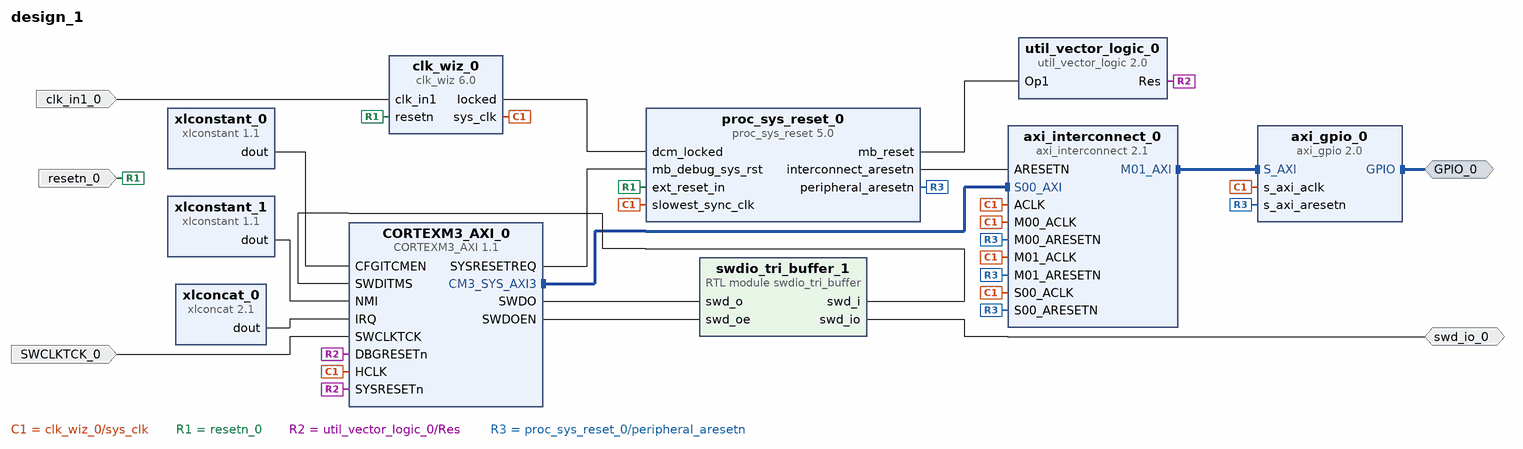
[diagram p0: block diagram of the top level]
# Vivado block design design_1, xc7a100tcsg324-3, Vivado 2019.2
create_bd_design design_1

create_bd_intf_port -mode Master -vlnv xilinx.com:interface:gpio_rtl:1.0 GPIO_0
create_bd_port -dir I -type clk clk_in1_0
set_property -dict {CONFIG.FREQ_HZ 100000000} [get_bd_ports clk_in1_0]
create_bd_port -dir I -type rst resetn_0
create_bd_port -dir I -type clk SWCLKTCK_0
create_bd_port -dir IO swd_io_0

create_bd_cell -type ip -vlnv Arm.com:CortexM:CORTEXM3_AXI:1.1 CORTEXM3_AXI_0
set_property -dict [list \
  CONFIG.DTCM_SIZE {"0111"} \
  CONFIG.ITCM_INIT_RAM false \
  CONFIG.ITCM_SIZE {"0111"} \
  CONFIG.JTAG_PRESENT true \
  CONFIG.TRACE_LVL 0 \
] [get_bd_cells CORTEXM3_AXI_0]
create_bd_cell -type ip -vlnv xilinx.com:ip:axi_gpio:2.0 axi_gpio_0
set_property -dict {CONFIG.C_ALL_OUTPUTS 1 CONFIG.C_GPIO_WIDTH 16} [get_bd_cells axi_gpio_0]
create_bd_cell -type ip -vlnv xilinx.com:ip:axi_interconnect:2.1 axi_interconnect_0
create_bd_cell -type ip -vlnv xilinx.com:ip:clk_wiz:6.0 clk_wiz_0
set_property -dict [list \
  CONFIG.CLKIN1_JITTER_PS 100.0 \
  CONFIG.CLKOUT1_JITTER 151.636 \
  CONFIG.CLKOUT1_PHASE_ERROR 98.575 \
  CONFIG.CLKOUT1_REQUESTED_OUT_FREQ 50 \
  CONFIG.CLK_OUT1_PORT sys_clk \
  CONFIG.MMCM_CLKFBOUT_MULT_F 10.000 \
  CONFIG.MMCM_CLKIN1_PERIOD 10.000 \
  CONFIG.MMCM_CLKIN2_PERIOD 10.000 \
  CONFIG.MMCM_CLKOUT0_DIVIDE_F 20.000 \
  CONFIG.PRIM_IN_FREQ 100.000 \
  CONFIG.RESET_PORT resetn \
  CONFIG.RESET_TYPE ACTIVE_LOW \
] [get_bd_cells clk_wiz_0]
create_bd_cell -type ip -vlnv xilinx.com:ip:proc_sys_reset:5.0 proc_sys_reset_0
create_bd_cell -type module -reference swdio_tri_buffer swdio_tri_buffer_1
create_bd_cell -type ip -vlnv xilinx.com:ip:util_vector_logic:2.0 util_vector_logic_0
set_property -dict {CONFIG.C_OPERATION not} [get_bd_cells util_vector_logic_0]
create_bd_cell -type ip -vlnv xilinx.com:ip:xlconcat:2.1 xlconcat_0
create_bd_cell -type ip -vlnv xilinx.com:ip:xlconstant:1.1 xlconstant_0
set_property -dict {CONFIG.CONST_WIDTH 2} [get_bd_cells xlconstant_0]
create_bd_cell -type ip -vlnv xilinx.com:ip:xlconstant:1.1 xlconstant_1
set_property -dict {CONFIG.CONST_VAL 0} [get_bd_cells xlconstant_1]

# ---- connections ----

connect_bd_intf_net [get_bd_intf_pins CORTEXM3_AXI_0/CM3_SYS_AXI3] [get_bd_intf_pins axi_interconnect_0/S00_AXI]
connect_bd_intf_net [get_bd_intf_pins axi_interconnect_0/M01_AXI] [get_bd_intf_pins axi_gpio_0/S_AXI]
connect_bd_intf_net [get_bd_intf_ports GPIO_0] [get_bd_intf_pins axi_gpio_0/GPIO]
connect_bd_net [get_bd_pins clk_wiz_0/sys_clk] \
  [get_bd_pins CORTEXM3_AXI_0/HCLK] [get_bd_pins axi_gpio_0/s_axi_aclk] [get_bd_pins axi_interconnect_0/ACLK] \
  [get_bd_pins axi_interconnect_0/S00_ACLK] [get_bd_pins axi_interconnect_0/M00_ACLK] \
  [get_bd_pins axi_interconnect_0/M01_ACLK] [get_bd_pins proc_sys_reset_0/slowest_sync_clk]
connect_bd_net [get_bd_pins proc_sys_reset_0/mb_reset] [get_bd_pins util_vector_logic_0/Op1]
connect_bd_net [get_bd_pins CORTEXM3_AXI_0/SYSRESETREQ] [get_bd_pins proc_sys_reset_0/mb_debug_sys_rst]
connect_bd_net [get_bd_pins clk_wiz_0/locked] [get_bd_pins proc_sys_reset_0/dcm_locked]
connect_bd_net -net clk_in1_0_1 [get_bd_ports clk_in1_0] [get_bd_pins clk_wiz_0/clk_in1]
connect_bd_net -net resetn_0_1 [get_bd_ports resetn_0] [get_bd_pins clk_wiz_0/resetn] [get_bd_pins proc_sys_reset_0/ext_reset_in]
connect_bd_net -net SWCLKTCK_0_1 [get_bd_ports SWCLKTCK_0] [get_bd_pins CORTEXM3_AXI_0/SWCLKTCK]
connect_bd_net [get_bd_pins CORTEXM3_AXI_0/SWDO] [get_bd_pins swdio_tri_buffer_1/swd_o]
connect_bd_net [get_bd_pins swdio_tri_buffer_1/swd_i] [get_bd_pins CORTEXM3_AXI_0/SWDITMS]
connect_bd_net [get_bd_pins CORTEXM3_AXI_0/SWDOEN] [get_bd_pins swdio_tri_buffer_1/swd_oe]
connect_bd_net [get_bd_ports swd_io_0] [get_bd_pins swdio_tri_buffer_1/swd_io]
connect_bd_net [get_bd_pins util_vector_logic_0/Res] [get_bd_pins CORTEXM3_AXI_0/SYSRESETn] [get_bd_pins CORTEXM3_AXI_0/DBGRESETn]
connect_bd_net [get_bd_pins proc_sys_reset_0/interconnect_aresetn] [get_bd_pins axi_interconnect_0/ARESETN]
connect_bd_net [get_bd_pins proc_sys_reset_0/peripheral_aresetn] \
  [get_bd_pins axi_gpio_0/s_axi_aresetn] [get_bd_pins axi_interconnect_0/S00_ARESETN] \
  [get_bd_pins axi_interconnect_0/M00_ARESETN] [get_bd_pins axi_interconnect_0/M01_ARESETN]
connect_bd_net [get_bd_pins xlconstant_0/dout] [get_bd_pins CORTEXM3_AXI_0/CFGITCMEN]
connect_bd_net [get_bd_pins xlconstant_1/dout] [get_bd_pins CORTEXM3_AXI_0/NMI]
connect_bd_net [get_bd_pins xlconcat_0/dout] [get_bd_pins CORTEXM3_AXI_0/IRQ]

# ---- address map ----
assign_bd_address -offset 0x40000000 -range 64K -target_address_space [get_bd_addr_spaces CORTEXM3_AXI_0/CM3_SYS_AXI3] [get_bd_addr_segs axi_gpio_0/S_AXI/Reg]

validate_bd_design
save_bd_design
